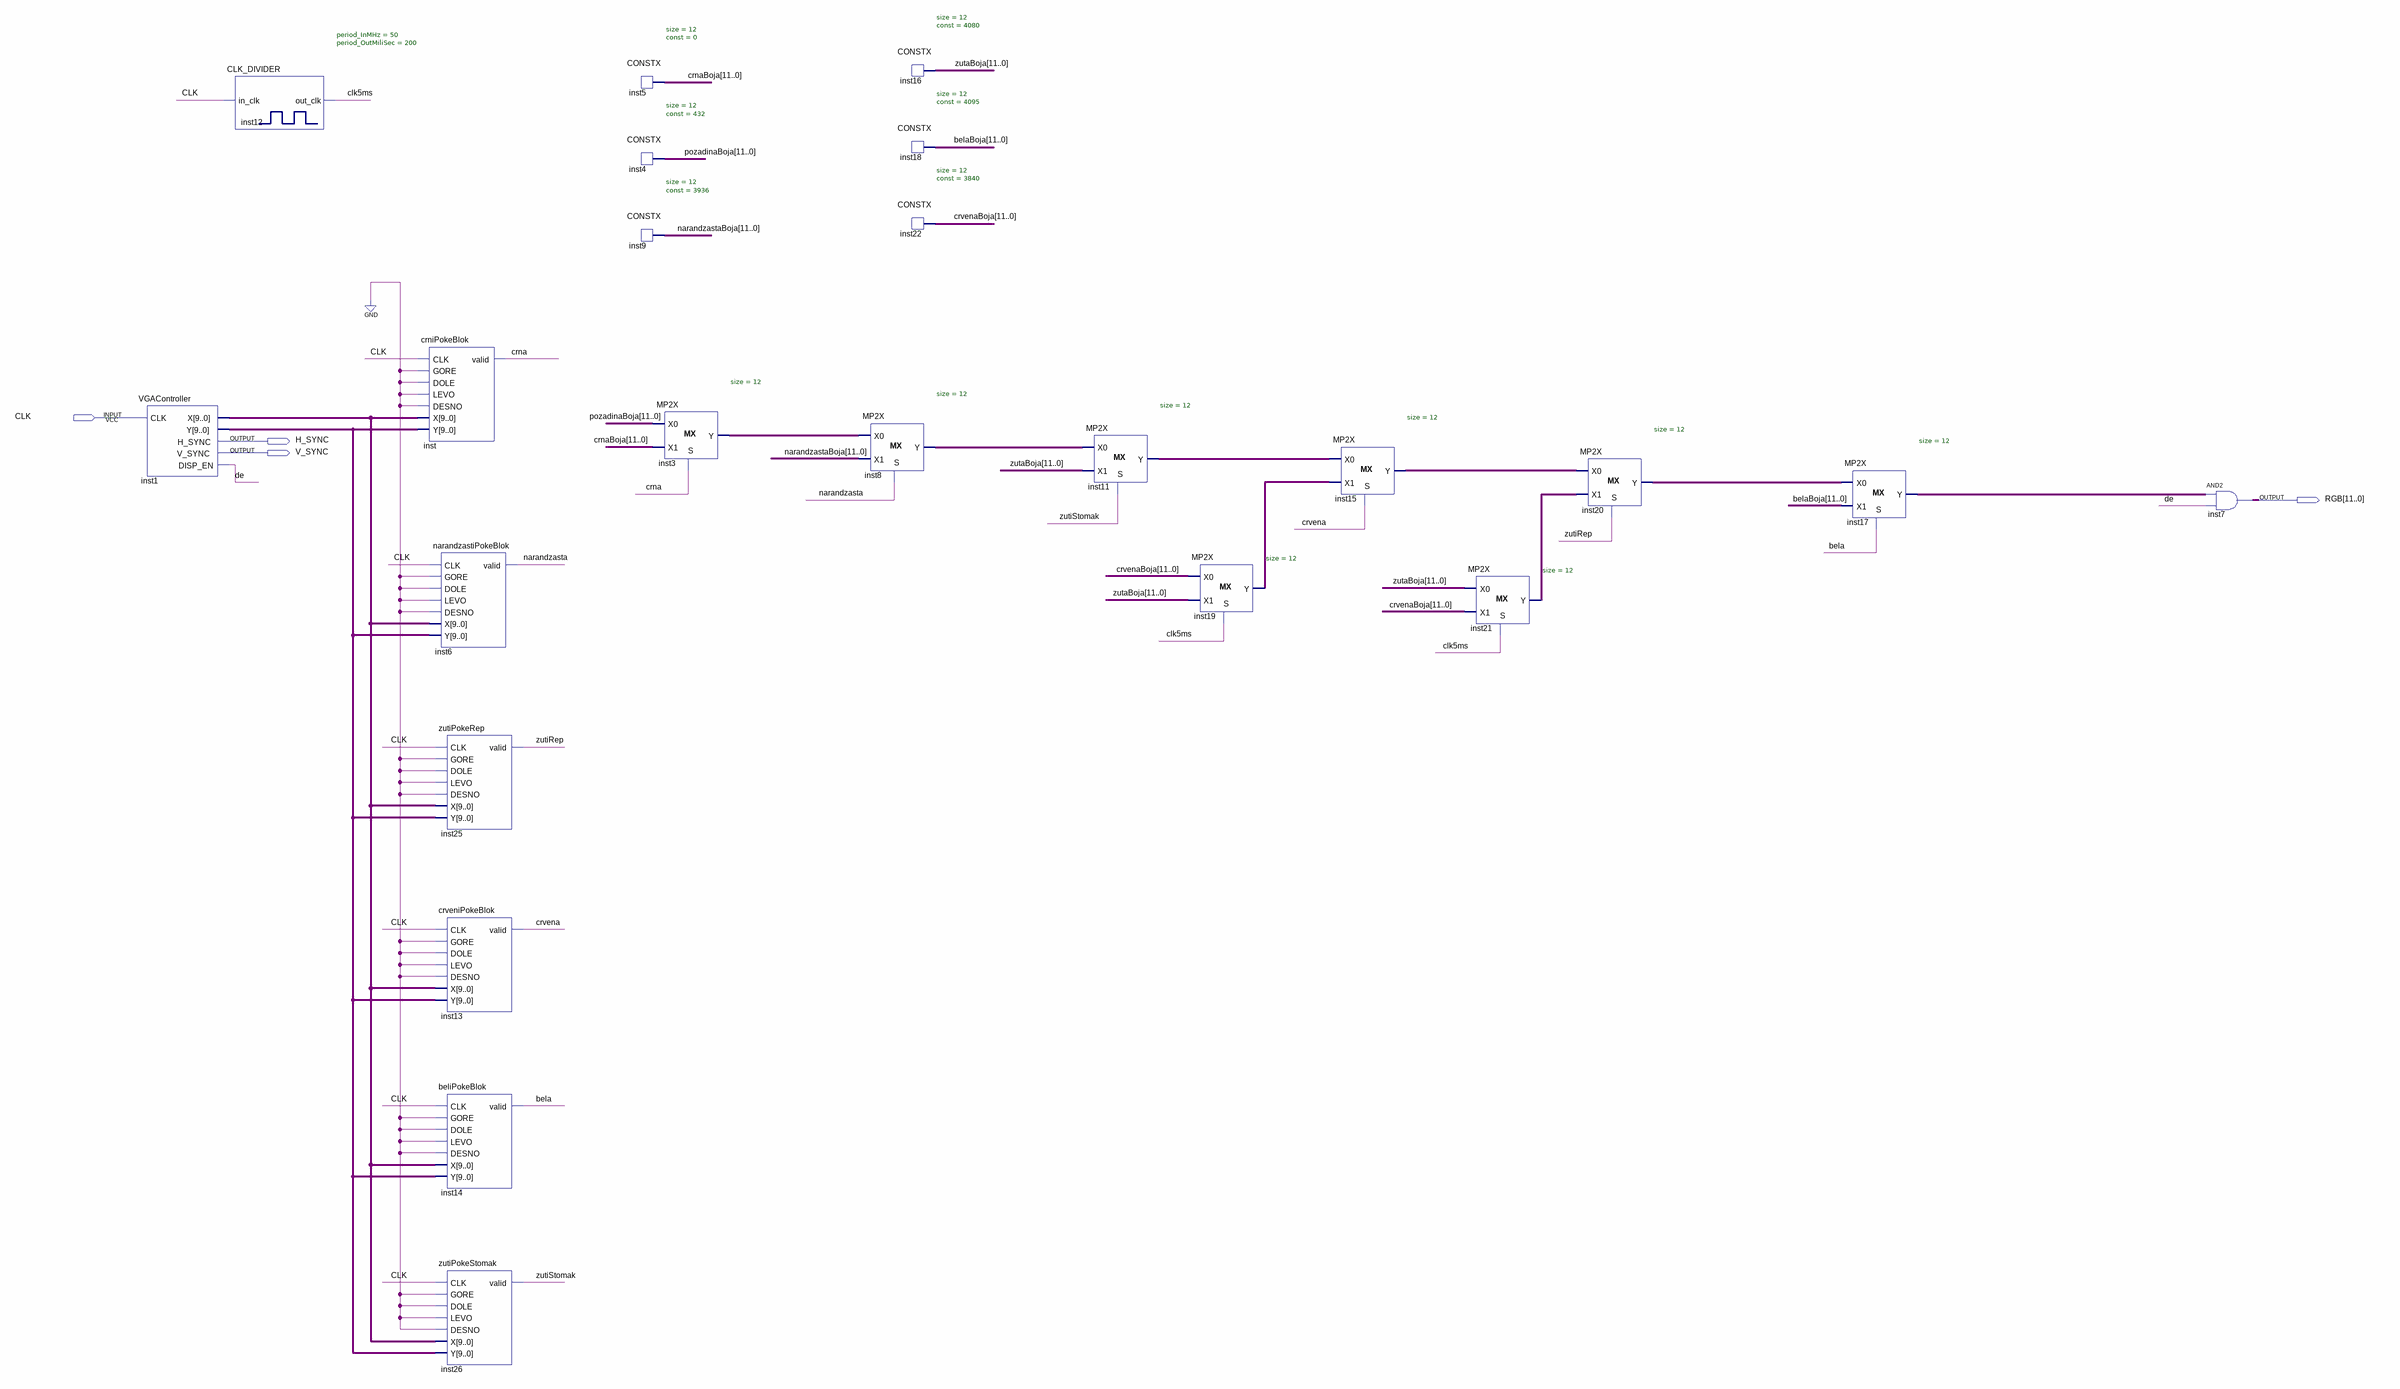
[diagram p0: schematic sheet]
// Quartus schematic crniPokeTest.bdf as structural Verilog: 23 symbols, 4 pins
module crniPokeTest (
  input  CLK,
  output H_SYNC,
  output V_SYNC,
  output [11:0] RGB
);

  wire bela, clk5ms, crna, crvena, de, narandzasta, zutiRep, zutiStomak;
  wire [9:0] inst1_x, inst1_y;
  wire [11:0] belaBoja, crnaBoja, crvenaBoja, inst3_y, inst8_y, inst11_y, inst15_y, inst17_y, inst19_y,
       inst20_y, inst21_y, narandzastaBoja, pozadinaBoja, zutaBoja;

  VGAController inst1 (.CLK(CLK), .X(inst1_x), .Y(inst1_y), .H_SYNC(H_SYNC), .V_SYNC(V_SYNC), .DISP_EN(de));
  CLK_DIVIDER #(.period_InMHz(50), .period_OutMiliSec(200)) inst12 (.in_clk(CLK), .out_clk(clk5ms));
  crniPokeBlok inst (
    .CLK(CLK), .GORE(1'b0), .DOLE(1'b0), .LEVO(1'b0), .DESNO(1'b0), .X(inst1_x), .Y(inst1_y), .valid(crna));
  narandzastiPokeBlok inst6 (
    .CLK(CLK), .GORE(1'b0), .DOLE(1'b0), .LEVO(1'b0), .DESNO(1'b0), .X(inst1_x), .Y(inst1_y),
    .valid(narandzasta));
  zutiPokeRep inst25 (
    .CLK(CLK), .GORE(1'b0), .DOLE(1'b0), .LEVO(1'b0), .DESNO(1'b0), .X(inst1_x), .Y(inst1_y), .valid(zutiRep));
  crveniPokeBlok inst13 (
    .CLK(CLK), .GORE(1'b0), .DOLE(1'b0), .LEVO(1'b0), .DESNO(1'b0), .X(inst1_x), .Y(inst1_y), .valid(crvena));
  beliPokeBlok inst14 (
    .CLK(CLK), .GORE(1'b0), .DOLE(1'b0), .LEVO(1'b0), .DESNO(1'b0), .X(inst1_x), .Y(inst1_y), .valid(bela));
  zutiPokeStomak inst26 (
    .CLK(CLK), .GORE(1'b0), .DOLE(1'b0), .LEVO(1'b0), .DESNO(1'b0), .X(inst1_x), .Y(inst1_y),
    .valid(zutiStomak));
  CONSTX #(.size(12), .\const (0)) inst5 (.data(crnaBoja));
  CONSTX #(.size(12), .\const (432)) inst4 (.data(pozadinaBoja));
  CONSTX #(.size(12), .\const (3936)) inst9 (.data(narandzastaBoja));
  MP2X #(.size(12)) inst3 (.S(crna), .X0(pozadinaBoja), .X1(crnaBoja), .Y(inst3_y));
  CONSTX #(.size(12), .\const (4080)) inst16 (.data(zutaBoja));
  CONSTX #(.size(12), .\const (4095)) inst18 (.data(belaBoja));
  CONSTX #(.size(12), .\const (3840)) inst22 (.data(crvenaBoja));
  MP2X #(.size(12)) inst8 (.S(narandzasta), .X0(inst3_y), .X1(narandzastaBoja), .Y(inst8_y));
  MP2X #(.size(12)) inst11 (.S(zutiStomak), .X0(inst8_y), .X1(zutaBoja), .Y(inst11_y));
  MP2X #(.size(12)) inst19 (.S(clk5ms), .X0(crvenaBoja), .X1(zutaBoja), .Y(inst19_y));
  MP2X #(.size(12)) inst15 (.S(crvena), .X0(inst11_y), .X1(inst19_y), .Y(inst15_y));
  MP2X #(.size(12)) inst21 (.S(clk5ms), .X0(zutaBoja), .X1(crvenaBoja), .Y(inst21_y));
  MP2X #(.size(12)) inst20 (.S(zutiRep), .X0(inst15_y), .X1(inst21_y), .Y(inst20_y));
  MP2X #(.size(12)) inst17 (.S(bela), .X0(inst20_y), .X1(belaBoja), .Y(inst17_y));
  assign RGB = inst17_y & {12{de}};  // AND2 inst7, 12 bits wide
endmodule
